# EAGLE design MOD-Y_V10 (EAGLE 9.6.2)

## Sheet 1 of 2
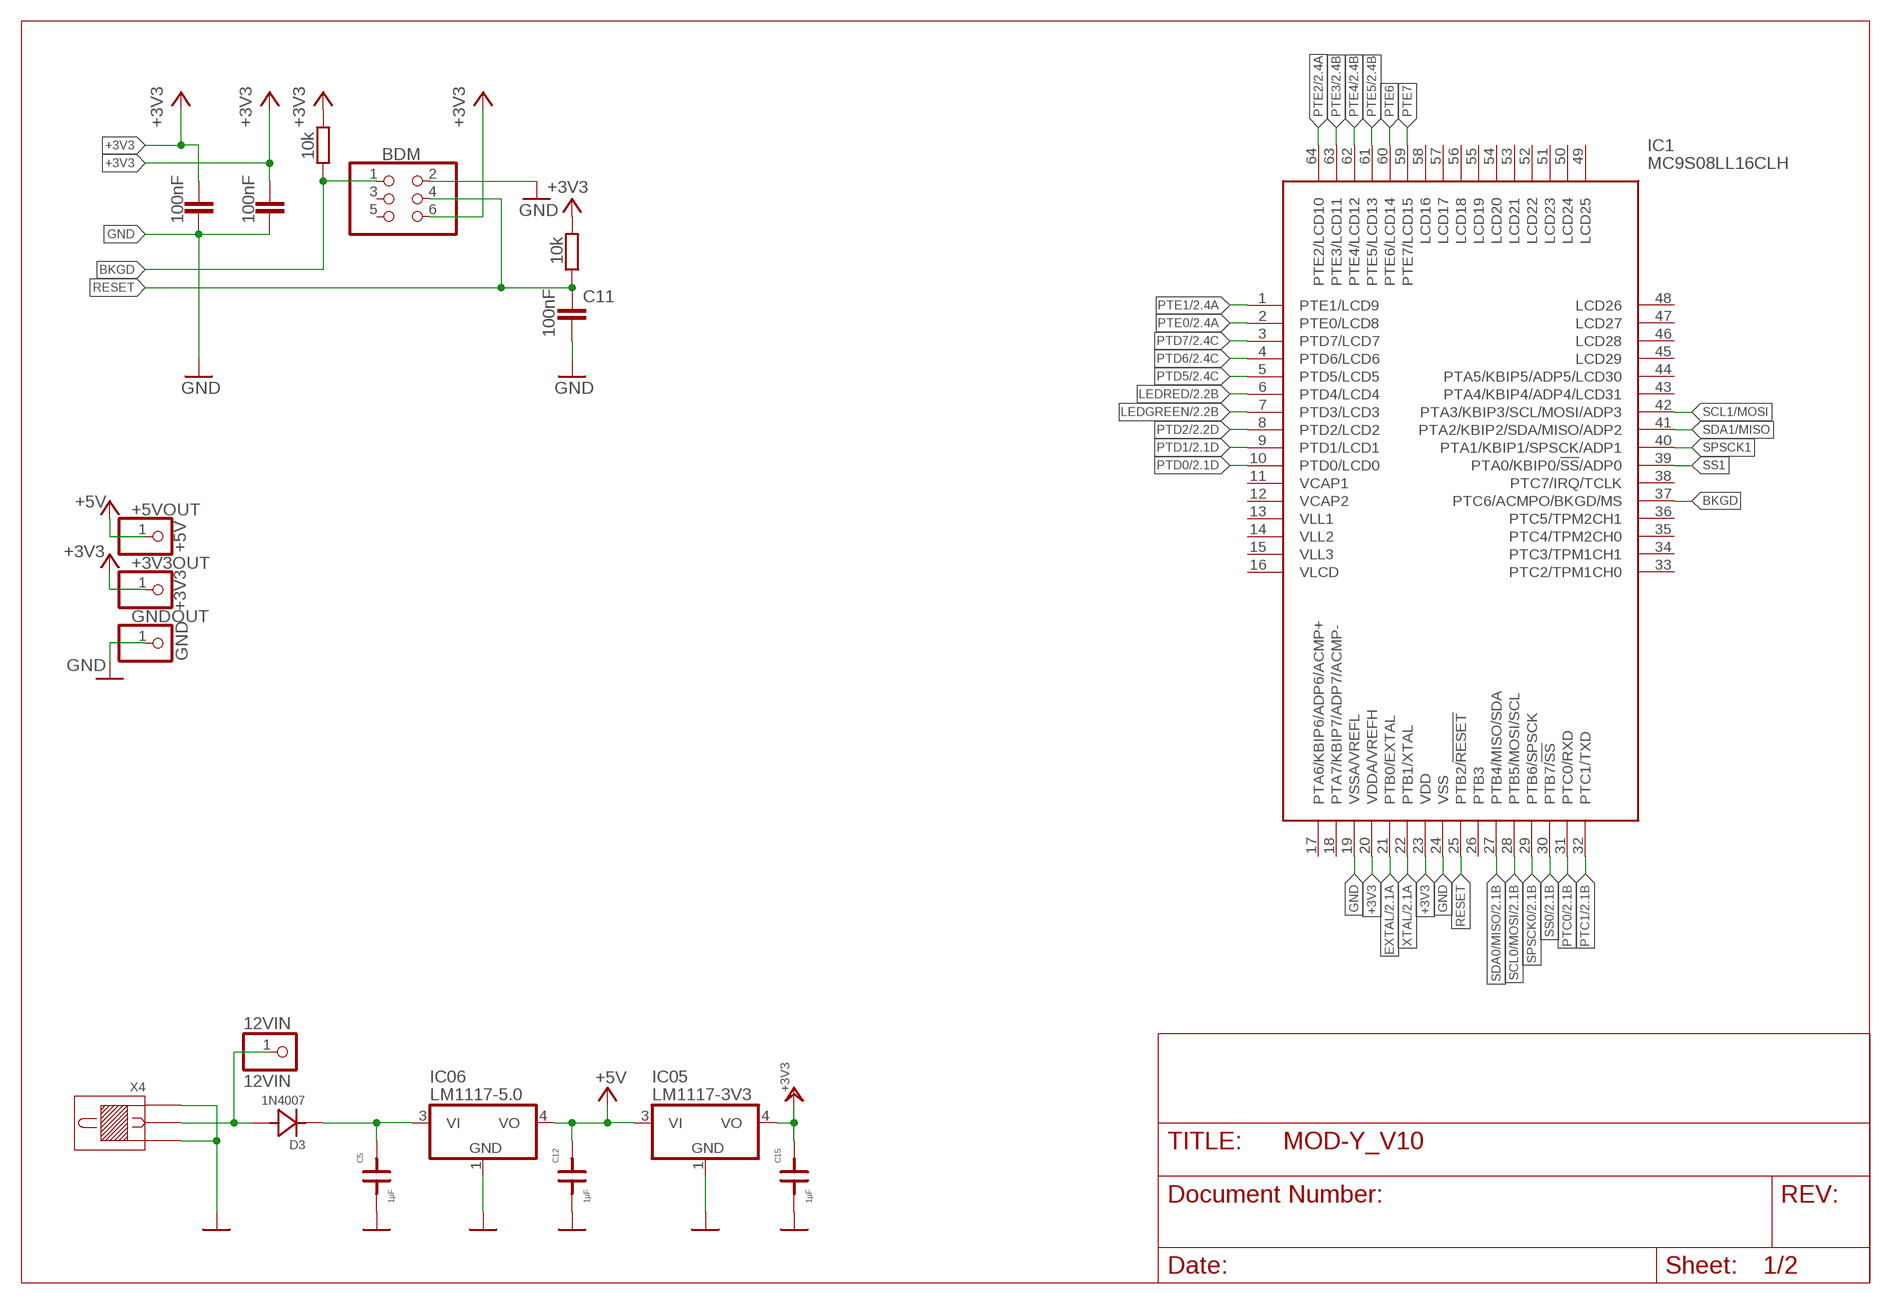
[diagram p0: schematic, sheet 1]

### Parts
12VIN  12VIN  PINHD-1X1  [1X01]
+3V3OUT  +3V3  PINHD-1X1  [1X01]
+5VOUT  +5V  PINHD-1X1  [1X01]
BDM  PINHD-2X3  [2X03]
C5  1µF  C1  [0805F]
C9  100nF  C-EUC0805  [C0805]
C10  100nF  C-EUC0805  [C0805]
C11  100nF  C-EUC0805  [C0805]
C12  1µF  C1  [0805F]
C15  1µF  C1  [0805F]
D3  1N4007  DHCMELF  [MELF_B]
GNDOUT  GND  PINHD-1X1  [1X01]
IC1  MC9S08LL16CLH  [QFP50P1200X1200X160-64N]
IC05  LM1117-3V3  LM1117DT  [DPAK]
IC06  LM1117-5.0  LM1117DT  [DPAK]
R16  10k  R-EU_R0805  [R0805]
R17  10k  R-EU_R0805  [R0805]
X4  SPP  [SPP]

### Nets
+3V3: +3V3OUT.1 BDM.6 C9.1 C10.1 C15.2 IC1.20(VDDA/VREFH) IC1.23(VDD) IC05.4(VO) R16.2 R17.2 ; also sheet 2
+5V: +5VOUT.1 C12.2 IC05.3(VI) IC06.4(VO) ; also sheet 2
BKGD: BDM.1 IC1.37(PTC6/ACMPO/BKGD/MS) R16.1
EXTAL: IC1.21(PTB0/EXTAL) ; also sheet 2
GND: BDM.2 C5.1 C9.2 C10.2 C11.2 C12.1 C15.1 GNDOUT.1 IC1.19(VSSA/VREFL) IC1.24(VSS) IC05.1(GND) IC06.1(GND) X4.1 X4.3 ; also sheet 2
LEDGREEN: IC1.7(PTD3/LCD3) ; also sheet 2
LEDRED: IC1.6(PTD4/LCD4) ; also sheet 2
N$70: C5.2 D3.K IC06.3(VI)
N$71: 12VIN.1 D3.A X4.2
PTC0: IC1.31(PTC0/RXD) ; also sheet 2
PTC1: IC1.32(PTC1/TXD) ; also sheet 2
PTD0: IC1.10(PTD0/LCD0) ; also sheet 2
PTD1: IC1.9(PTD1/LCD1) ; also sheet 2
PTD2: IC1.8(PTD2/LCD2) ; also sheet 2
PTD5: IC1.5(PTD5/LCD5) ; also sheet 2
PTD6: IC1.4(PTD6/LCD6) ; also sheet 2
PTD7: IC1.3(PTD7/LCD7) ; also sheet 2
PTE0: IC1.2(PTE0/LCD8) ; also sheet 2
PTE1: IC1.1(PTE1/LCD9) ; also sheet 2
PTE2: IC1.64(PTE2/LCD10) ; also sheet 2
PTE3: IC1.63(PTE3/LCD11) ; also sheet 2
PTE4: IC1.62(PTE4/LCD12) ; also sheet 2
PTE5: IC1.61(PTE5/LCD13) ; also sheet 2
PTE6: IC1.60(PTE6/LCD14)
PTE7: IC1.59(PTE7/LCD15)
RESET: BDM.4 C11.1 IC1.25(PTB2/!RESET) R17.1
SCL0/MOSI: IC1.28(PTB5/MOSI/SCL) ; also sheet 2
SCL1/MOSI: IC1.42(PTA3/KBIP3/SCL/MOSI/ADP3)
SDA0/MISO: IC1.27(PTB4/MISO/SDA) ; also sheet 2
SDA1/MISO: IC1.41(PTA2/KBIP2/SDA/MISO/ADP2)
SPSCK0: IC1.29(PTB6/SPSCK) ; also sheet 2
SPSCK1: IC1.40(PTA1/KBIP1/SPSCK/ADP1)
SS0: IC1.30(PTB7/!SS) ; also sheet 2
SS1: IC1.39(PTA0/KBIP0/!SS!/ADP0)
XTAL: IC1.22(PTB1/XTAL) ; also sheet 2
Unconnected: BDM.3 BDM.5 IC1.11(VCAP1) IC1.12(VCAP2) IC1.13(VLL1) IC1.14(VLL2) IC1.15(VLL3) IC1.16(VLCD) IC1.17(PTA6/KBIP6/ADP6/ACMP+) IC1.18(PTA7/KBIP7/ADP7/ACMP-) IC1.26(PTB3) IC1.33(PTC2/TPM1CH0) IC1.34(PTC3/TPM1CH1) IC1.35(PTC4/TPM2CH0) IC1.36(PTC5/TPM2CH1) IC1.38(PTC7/IRQ/TCLK) IC1.43(PTA4/KBIP4/ADP4/LCD31) IC1.44(PTA5/KBIP5/ADP5/LCD30) IC1.45(LCD29) IC1.46(LCD28) IC1.47(LCD27) IC1.48(LCD26) IC1.49(LCD25) IC1.50(LCD24) IC1.51(LCD23) IC1.52(LCD22) IC1.53(LCD21) IC1.54(LCD20) IC1.55(LCD19) IC1.56(LCD18) IC1.57(LCD17) IC1.58(LCD16)

## Sheet 2 of 2
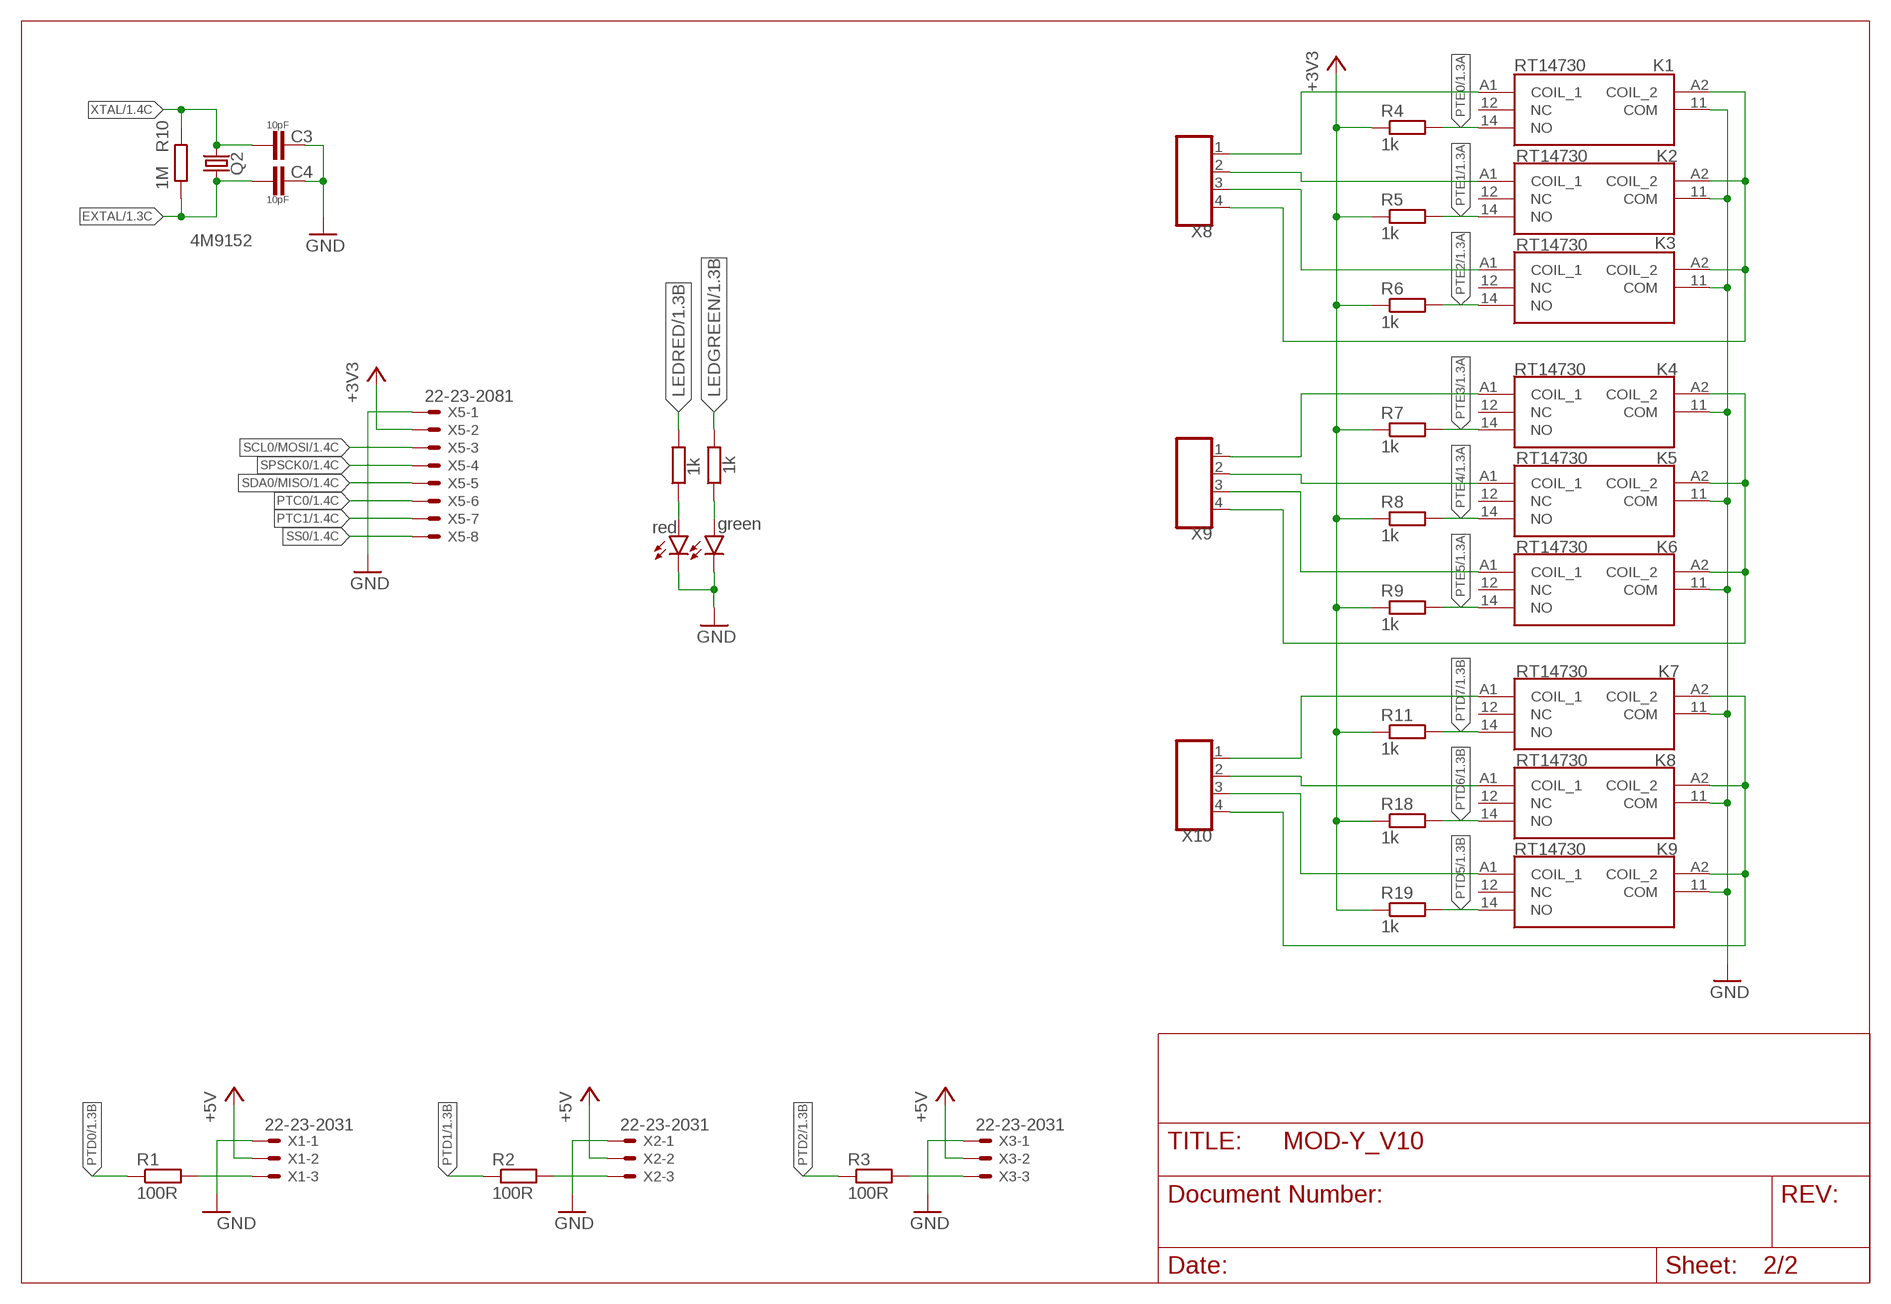
[diagram p1: schematic, sheet 2]

### Parts
C3  10pF  C-EUC0805  [C0805]
C4  10pF  C-EUC0805  [C0805]
K1  RT14730  [RT14730]
K2  RT14730  [RT14730]
K3  RT14730  [RT14730]
K4  RT14730  [RT14730]
K5  RT14730  [RT14730]
K6  RT14730  [RT14730]
K7  RT14730  [RT14730]
K8  RT14730  [RT14730]
K9  RT14730  [RT14730]
LED1  green  LEDCHIP-LED0805  [CHIP-LED0805]
LED2  red  LEDCHIP-LED0805  [CHIP-LED0805]
Q2  4M9152  CRYSTALHC49UP  [HC49UP]
R1  100R  R-EU_R0805  [R0805]
R2  100R  R-EU_R0805  [R0805]
R3  100R  R-EU_R0805  [R0805]
R4  1k  R-EU_R0805  [R0805]
R5  1k  R-EU_R0805  [R0805]
R6  1k  R-EU_R0805  [R0805]
R7  1k  R-EU_R0805  [R0805]
R8  1k  R-EU_R0805  [R0805]
R9  1k  R-EU_R0805  [R0805]
R10  1M  R-EU_R0805  [R0805]
R11  1k  R-EU_R0805  [R0805]
R12  1k  R-EU_R0805  [R0805]
R13  1k  R-EU_R0805  [R0805]
R18  1k  R-EU_R0805  [R0805]
R19  1k  R-EU_R0805  [R0805]
X1  22-23-2031  [22-23-2031]
X2  22-23-2031  [22-23-2031]
X3  22-23-2031  [22-23-2031]
X5  22-23-2081  [22-23-2081]
X8  KLEMME4  [KLEMME4]
X9  KLEMME4  [KLEMME4]
X10  KLEMME4  [KLEMME4]

### Nets
+3V3: R4.1 R5.1 R6.1 R7.1 R8.1 R9.1 R11.1 R18.1 R19.1 X5.2 ; also sheet 1
+5V: X1.2 X2.2 X3.2 ; also sheet 1
EXTAL: C4.1 Q2.1 R10.1 ; also sheet 1
GND: C3.2 C4.2 K1.11(COM) K2.11(COM) K3.11(COM) K4.11(COM) K5.11(COM) K6.11(COM) K7.11(COM) K8.11(COM) K9.11(COM) LED1.C LED2.C X1.1 X2.1 X3.1 X5.1 ; also sheet 1
LEDGREEN: R13.2 ; also sheet 1
LEDRED: R12.2 ; also sheet 1
N$1: K1.A1(COIL_1) X8.1
N$2: K2.A1(COIL_1) X8.2
N$3: R1.2 X1.3
N$4: K3.A1(COIL_1) X8.3
N$5: K1.A2(COIL_2) K2.A2(COIL_2) K3.A2(COIL_2) X8.4
N$6: R2.2 X2.3
N$7: K4.A1(COIL_1) X9.1
N$10: K5.A1(COIL_1) X9.2
N$11: R3.2 X3.3
N$12: K6.A1(COIL_1) X9.3
N$13: K4.A2(COIL_2) K5.A2(COIL_2) K6.A2(COIL_2) X9.4
N$14: K7.A1(COIL_1) X10.1
N$15: K8.A1(COIL_1) X10.2
N$16: K9.A1(COIL_1) X10.3
N$17: LED2.A R12.1
N$18: LED1.A R13.1
N$19: K7.A2(COIL_2) K8.A2(COIL_2) K9.A2(COIL_2) X10.4
PTC0: X5.6 ; also sheet 1
PTC1: X5.7 ; also sheet 1
PTD0: R1.1 ; also sheet 1
PTD1: R2.1 ; also sheet 1
PTD2: R3.1 ; also sheet 1
PTD5: K9.14(NO) R19.2 ; also sheet 1
PTD6: K8.14(NO) R18.2 ; also sheet 1
PTD7: K7.14(NO) R11.2 ; also sheet 1
PTE0: K1.14(NO) R4.2 ; also sheet 1
PTE1: K2.14(NO) R5.2 ; also sheet 1
PTE2: K3.14(NO) R6.2 ; also sheet 1
PTE3: K4.14(NO) R7.2 ; also sheet 1
PTE4: K5.14(NO) R8.2 ; also sheet 1
PTE5: K6.14(NO) R9.2 ; also sheet 1
SCL0/MOSI: X5.3 ; also sheet 1
SDA0/MISO: X5.5 ; also sheet 1
SPSCK0: X5.4 ; also sheet 1
SS0: X5.8 ; also sheet 1
XTAL: C3.1 Q2.2 R10.2 ; also sheet 1
Unconnected: K1.12(NC) K2.12(NC) K3.12(NC) K4.12(NC) K5.12(NC) K6.12(NC) K7.12(NC) K8.12(NC) K9.12(NC)

## Library data of the parts
12VIN +3V3OUT +5VOUT GNDOUT = pinhead:PINHD-1X1: PIN HEADER
BDM = pinhead:PINHD-2X3: PIN HEADER
C3 C4 C9-C11 = rcl:C-EU: CAPACITOR, European symbol; SPICEPREFIX: C
C5 C12 C15 = deto:C
D3 = deto:DHC: Hii-Curr-Diode, Silizium, Typ Gleichrichter z.B. wie 1N4007 oder ähnlich
IC1 = MC9S08LL16CLH:MC9S08LL16CLH: MCU 8-bit S08 CISC 16KB Flash 2.5V/3.3V 64-Pin LQFP Tray Source: Datasheet <http://www.nxp.com/docs/en/data-sheet/MC9S08LL16.pdf>; ARROW_PART_NUMBER: MC9S08LL16CLH; ARROW_PRICE-STOCK: https://www.arrow.com/en/products/mc9s08ll16clh/nxp-semiconductors; DESCRIPTION: MCU 8-bit S08 CISC 16KB Flash 2.5V/3.3V 64-Pin LQFP Tray; HEIGHT: 1.6mm; MANUFACTURER_NAME: NXP; MANUFACTURER_PART_NUMBER: MC9S08LL16CLH; MOUSER_PART_NUMBER: 841-MC9S08LL16CLH; MOUSER_PRICE-STOCK: https://www.mouser.com/Search/Refine.aspx?Keyword=841-MC9S08LL16CLH
IC05 IC06 = deto:LM1117: Spannungsregler Fix oder einstellbar LM1117XX-YY wobei XX die Gehäuseform angibt (DT = Dpak) und YY die Spannung angibt (z.B. 5.0 für 5V oder ADJ für einstellbar)
K1-K9 = rt14730:RT14730: Power PCB Relay RT1 Source: Datasheet <https://www.farnell.com/datasheets/2611146.pdf>; DESCRIPTION: Power PCB Relay RT1; HEIGHT: 15.7mm; MANUFACTURER_NAME: DEUTSCH - TE CONNECTIVITY; MANUFACTURER_PART_NUMBER: rt14730
LED1 LED2 = led:LED: LED OSRAM: - CHIPLED LG R971, LG N971, LY N971, LG Q971, LY Q971, LO R971, LY R971 LH N974, LH R974 LS Q976, LO Q976, LY Q976 LO Q996 - Hyper CHIPLED LW Q18S LB Q993, LB Q99A, LB R99A - SideLED LS A670, LO A670, LY A670, LG A670, LP A670 LB A673, LV A673, LT A673, LW A673 LH A674 LY A675 LS A676, LA A676, LO A676, LY A676, LW A676 LS A679, LY A679, LG A679 - Hyper Micro SIDELED® LS Y876, LA Y876, LO Y876, LY Y876 LT Y87S - SmartLED LW L88C, LW L88S LB L89C, LB L89S, LG L890 LS L89K, LO L89K, LY L89K LS L896, LA L896, LO L896, LY L896 - TOPLED LS T670, LO T670, LY T670, LG T670, LP T670 LSG T670, LSP T670, LSY T670, LOP T670, LYG T670 LG T671, LOG T671, LSG T671 LB T673, LV T673, LT T673, LW T673 LH T674 LS T676, LA T676, LO T676, LY T676, LB T676, LH T676, LSB T676, LW T676 LB T67C, LV T67C, LT T67C, LS T67K, LO T67K, LY T67K, LW E67C LS E67B, LA E67B, LO E67B, LY E67B, LB E67C, LV E67C, LT E67C LW T67C LS T679, LY T679, LG T679 LS T770, LO T770, LY T770, LG T770, LP T770 LB T773, LV T773, LT T773, LW T773 LH T774 LS E675, LA E675, LY E675, LS T675 LS T776, LA T776, LO T776, LY T776, LB T776 LHGB T686 LT T68C, LB T68C - Hyper Mini TOPLED® LB M676 - Mini TOPLED Santana® LG M470 LS M47K, LO M47K, LY M47K Source: http://www.osram.convergy.de LUXEON: - LUMILED® LXK2-PW12-R00, LXK2-PW12-S00, LXK2-PW14-U00, LXK2-PW14-V00 LXK2-PM12-R00, LXK2-PM12-S00, LXK2-PM14-U00 LXK2-PE12-Q00, LXK2-PE12-R00, LXK2-PE12-S00, LXK2-PE14-T00, LXK2-PE14-U00 LXK2-PB12-K00, LXK2-PB12-L00, LXK2-PB12-M00, LXK2-PB14-N00, LXK2-PB14-P00, LXK2-PB14-Q00 LXK2-PR12-L00, LXK2-PR12-M00, LXK2-PR14-Q00, LXK2-PR14-R00 LXK2-PD12-Q00, LXK2-PD12-R00, LXK2-PD12-S00 LXK2-PH12-R00, LXK2-PH12-S00 LXK2-PL12-P00, LXK2-PL12-Q00, LXK2-PL12-R00 Source: www.luxeon.com KINGBRIGHT: KA-3528ASYC Source: www.kingbright.com
Q2 = crystal:CRYSTAL: CRYSTAL; OC_FARNELL: unknown; OC_NEWARK: unknown
R1-R13 R16-R19 = rcl:R-EU_: RESISTOR, European symbol; SPICEPREFIX: R
X1-X3 = con-molex:22-23-2031: .100" (2.54mm) Center Header - 3 Pin; MF: MOLEX; MPN: 22-23-2031; OC_FARNELL: 1462950; OC_NEWARK: 30C0862
X4 = CONNECT:SPP
X5 = con-molex:22-23-2081: .100" (2.54mm) Center Header - 8 Pin; MF: MOLEX; MPN: 22-23-2081; OC_FARNELL: 1756826; OC_NEWARK: 01C7592
X8-X10 = CONNECT:KLEMME4

## Board
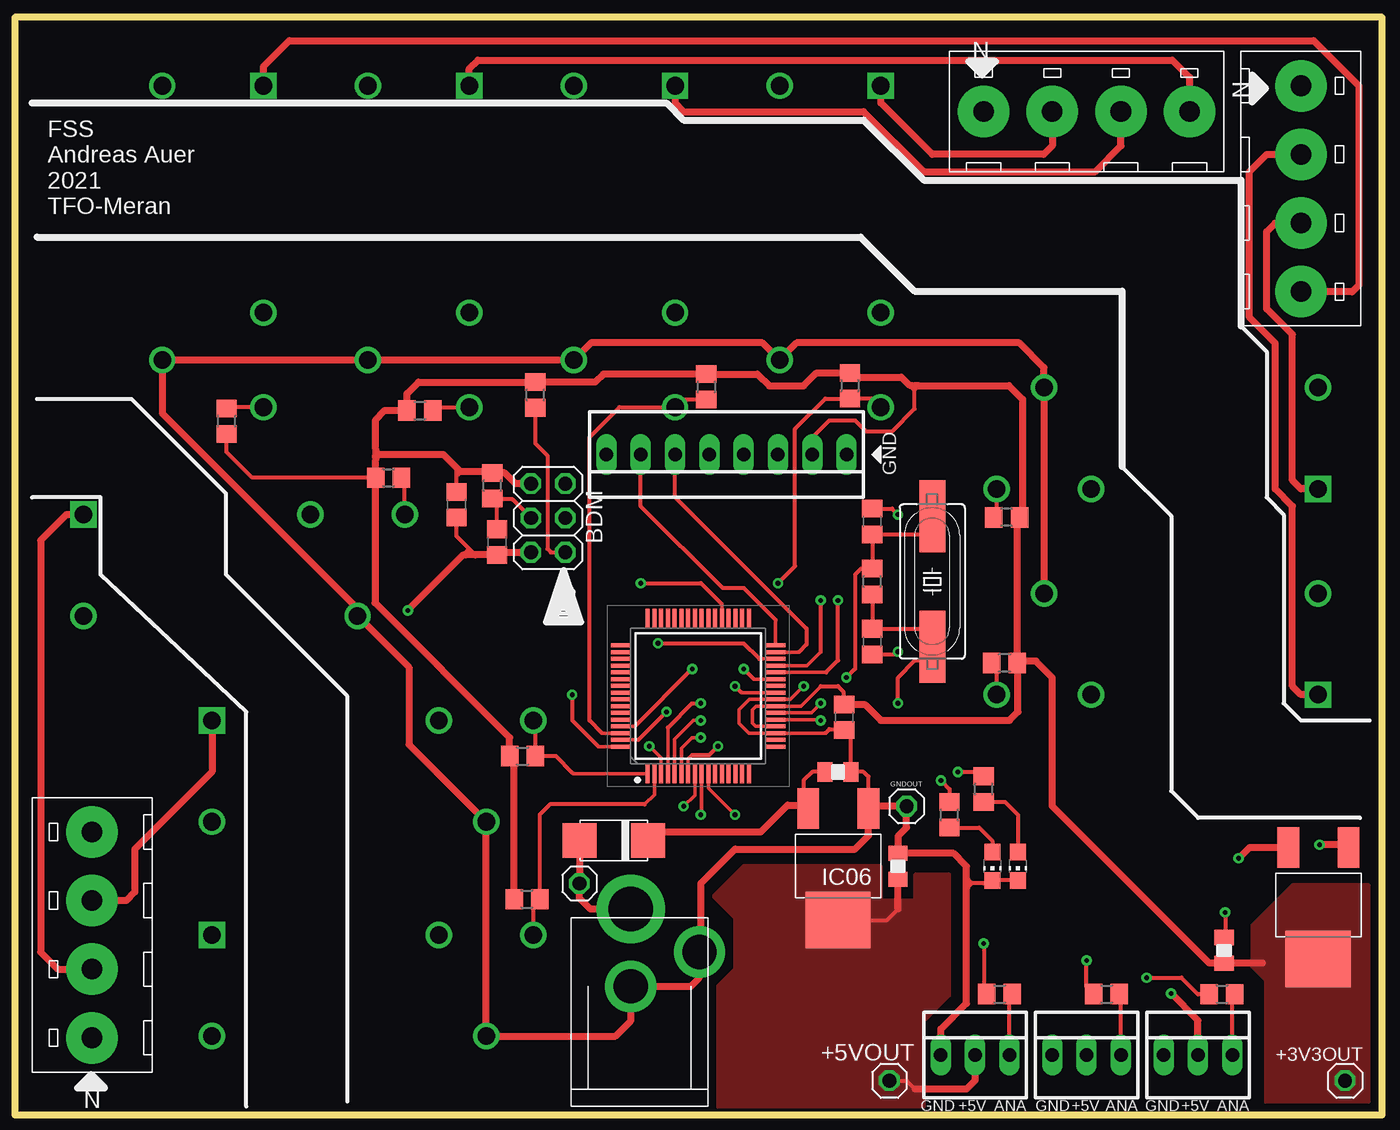
[diagram p2: board, top side]
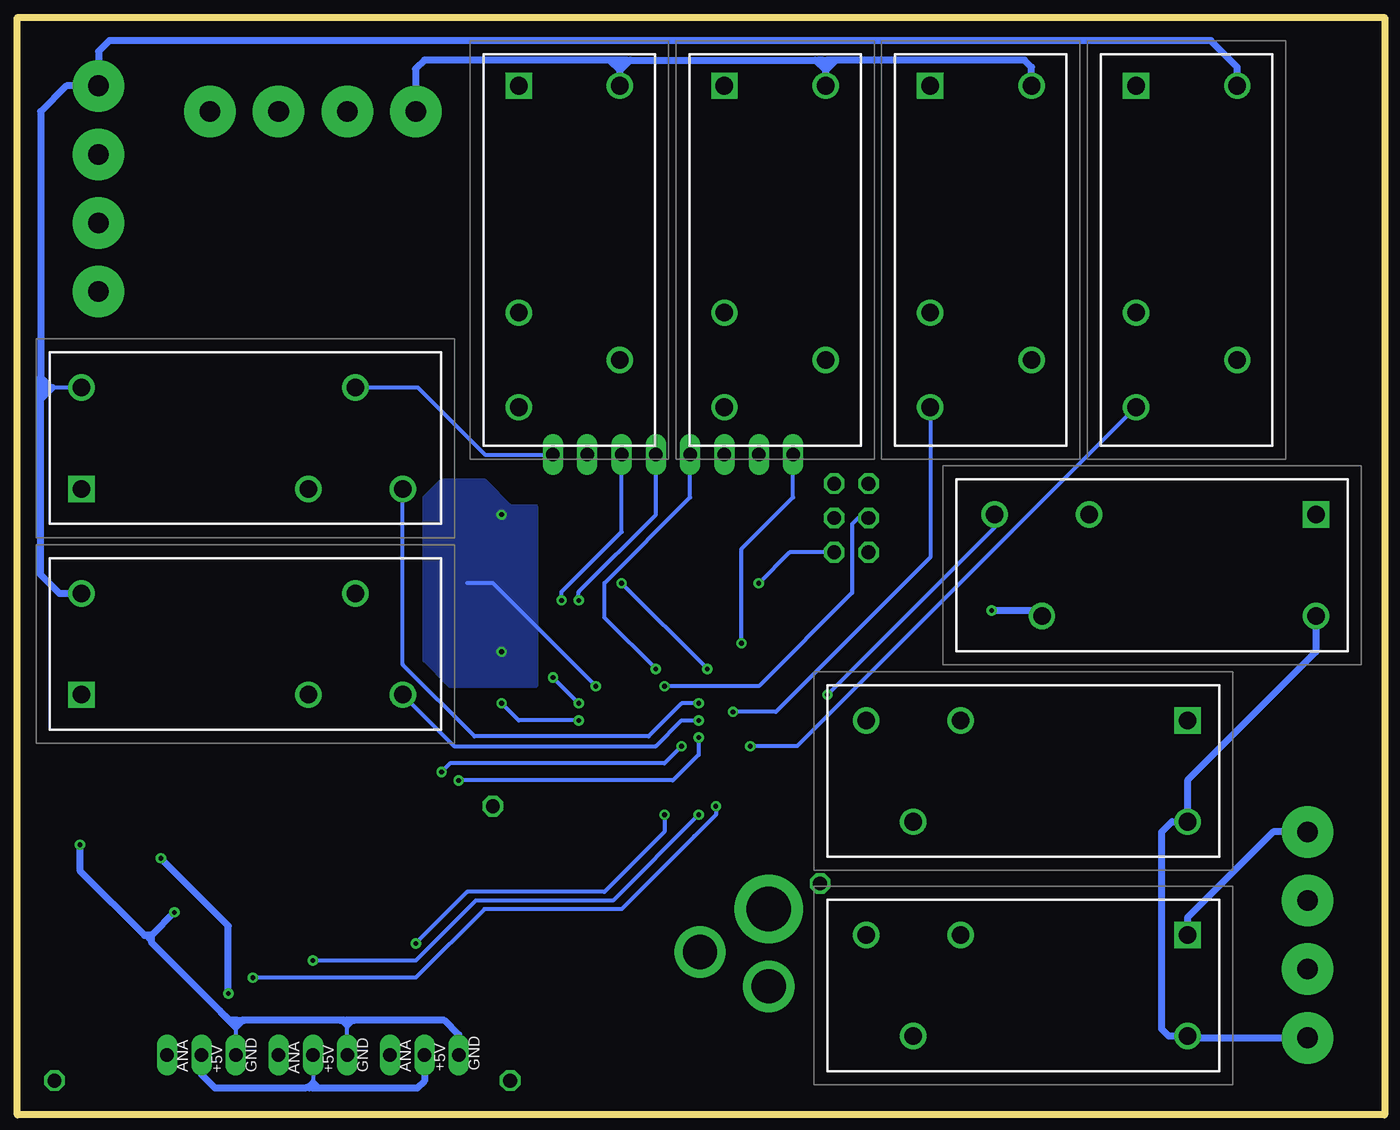
[diagram p3: board, bottom side, seen from below]

No outline drawn. Coordinates in mm, seen from the top.
Copper layers (1*16): Top 0.035mm / dielectric 1.5mm / Bottom 0.035mm
Design rules "default *": minimum track width 6mil, minimum drill 0.35mm, track to track 12mil, track to pad 12mil, pad to pad 12mil, via to via 12mil, smd to smd 12mil, copper to edge 40mil, drill to drill 12mil, minimum pad ring 10mil, minimum via ring 8mil, stop-mask expansion 4mil, vias tented up to drill 0mil, thermal gap 10mil
Milling: 4 lines

### Footprints (pad centres in the part's own frame; a part is rotated, then mirrored left to right if it is on the bottom)
1X01 = drill 1.016 octagon: 1 0,0
2X03 = drill 1.016 octagon: 1 -2.54,-1.27; 2 -2.54,1.27; 3 0,-1.27; 4 0,1.27; 5 2.54,-1.27; 6 2.54,1.27
C0805 = smd 1.3 x 1.5: 1 -0.95,0; 2 0.95,0
0805F = smd 1.118 x 1.422: 1 -0.953,0; 2 0.953,0
MELF_B = smd 2.54 x 2.54: A 2.54,0; K -2.54,0
QFP50P1200X1200X160-64N = smd 1.475 x 0.3: 1 -5.738,3.75; 2 -5.738,3.25; 3 -5.738,2.75; 4 -5.738,2.25; 5 -5.738,1.75; 6 -5.738,1.25; 7 -5.738,0.75; 8 -5.738,0.25; 9 -5.738,-0.25; 10 -5.738,-0.75; 11 -5.738,-1.25; 12 -5.738,-1.75; 13 -5.738,-2.25; 14 -5.738,-2.75; 15 -5.738,-3.25; 16 -5.738,-3.75; 33 5.738,-3.75; 34 5.738,-3.25; 35 5.738,-2.75; 36 5.738,-2.25; 37 5.738,-1.75; 38 5.738,-1.25; 39 5.738,-0.75; 40 5.738,-0.25; 41 5.738,0.25; 42 5.738,0.75; 43 5.738,1.25; 44 5.738,1.75; 45 5.738,2.25; 46 5.738,2.75; 47 5.738,3.25; 48 5.738,3.75 | smd 0.3 x 1.475: 17 -3.75,-5.738; 18 -3.25,-5.738; 19 -2.75,-5.738; 20 -2.25,-5.738; 21 -1.75,-5.738; 22 -1.25,-5.738; 23 -0.75,-5.738; 24 -0.25,-5.738; 25 0.25,-5.738; 26 0.75,-5.738; 27 1.25,-5.738; 28 1.75,-5.738; 29 2.25,-5.738; 30 2.75,-5.738; 31 3.25,-5.738; 32 3.75,-5.738; 49 3.75,5.738; 50 3.25,5.738; 51 2.75,5.738; 52 2.25,5.738; 53 1.75,5.738; 54 1.25,5.738; 55 0.75,5.738; 56 0.25,5.738; 57 -0.25,5.738; 58 -0.75,5.738; 59 -1.25,5.738; 60 -1.75,5.738; 61 -2.25,5.738; 62 -2.75,5.738; 63 -3.25,5.738; 64 -3.75,5.738
DPAK = smd 1.6 x 2.997: 1 -2.261,-3.658; 3 2.21,-3.658 | smd 4.826 x 4.191: 4 0,4.623
RT14730 = drill 1.3 pad 1.95: 11 20.3,7.5; 12 16.8,0; 14 23.8,0; A2 0,7.5 | drill 1.3 pad 1.95 square: A1 0,0
CHIP-LED0805 = smd 1.2 x 1.2: A 0,-1.05; C 0,1.05
HC49UP = smd 5.334 x 1.93: 1 -4.826,0; 2 4.826,0
R0805 = smd 1.3 x 1.5: 1 -0.95,0; 2 0.95,0
22-23-2031 = drill 1 long: 1 -2.54,0; 2 0,0; 3 2.54,0
SPP = drill 2.54 pad 3.81: 1 0,0; 3 -2.54,5.08 | drill 3.302 pad 5.08: 2 -5.715,0
22-23-2081 = drill 1 long: 1 -8.89,0; 2 -6.35,0; 3 -3.81,0; 4 -1.27,0; 5 1.27,0; 6 3.81,0; 7 6.35,0; 8 8.89,0
KLEMME4 = drill 1.524 pad 3.81: 1 0,-7.62; 2 0,-2.54; 3 0,2.54; 4 0,7.62

### Placement (x,y rotation side)
12VIN  41.18,17.14 0 top
+3V3OUT  97.89,2.54 0 top
+5VOUT  64.14,2.54 0 top
BDM  38.86,44.2 90 top
C3  62.87,43.94 90 top
C4  62.87,35.05 270 top
C5  60.33,25.4 180 top
C9  32.08,45.19 270 top
C10  60.79,29.45 270 top
C11  35.09,42.41 270 top
C12  64.77,18.41 270 top
C15  88.92,12.19 270 top
D3  43.72,20.32 180 top
GNDOUT  65.41,22.86 0 top
IC1  49.98,31.02 90 top
IC05  95.89,16.16 180 top
IC06  60.33,19.05 180 top
K1  13.97,13.34 180 bottom
K2  13.97,29.21 180 bottom
K3  4.45,44.45 180 bottom
K4  33.02,76.2 270 bottom
K5  48.26,76.2 270 bottom
K6  63.5,76.2 270 bottom
K7  17.78,76.2 270 bottom
K8  95.89,46.35 0 bottom
K9  95.89,31.11 0 bottom
LED1  73.66,18.41 180 top
LED2  71.75,18.41 180 top
Q2  67.31,39.49 90 top
R1  72.29,8.95 0 top
R2  80.21,8.95 0 top
R3  88.76,8.94 0 top
R4  37.29,15.98 0 top
R5  36.97,26.57 0 top
R6  27.04,47.19 0 top
R7  29.36,52.16 0 top
R8  50.57,53.91 270 top
R9  61.2,53.99 270 top
R10  62.87,39.49 90 top
R11  15.05,51.37 90 top
R12  68.58,22.23 90 top
R13  71.12,24.13 90 top
R16  37.91,53.31 90 top
R17  34.73,46.59 90 top
R18  72.81,44.24 180 top
R19  72.65,33.46 180 top
X1  70.48,4.45 0 top
X2  78.74,4.45 0 top
X3  87,4.45 0 top
X4  44.99,9.53 270 top
X5  52.07,48.9 180 top
X8  5.08,13.34 180 top
X9  78.74,74.3 90 top
X10  94.61,68.58 0 top

### Tracks (layer width: path | path; a pad name or v marks a point on that pad's centre or on a via)
+3V3
  Top 0.254: IC1.20 54.23,28.77 54,29 54,30 54.27,30.27 IC1.23 57.58,30.27 59.05,31.75
  Top 0.305: 36.34,26.25 R5.1 | R11.1 15.05,49.09 16.95,47.19 R6.1 26.04,47.13 | R9.1 61.51,54.63 | 74,44.48 R18.1 73.6,44.08 | R19.1 73.6,33.66 73.66,33.59 | 66,53.66 66,52.27 64.36,50.63 62.4,50.63 61.59,51.44 59.69,51.44 58.42,50.16 X5.2 | 66,53.71 66,53.83 | 66,53.83 66,54 66.17,54 66,53.83 | C10.1 60.73,30.46 60.73,31.34 60.33,31.75 59.05,31.75 | 66,53.83 65.83,54 65.66,54 66,53.66 | 66,53.71 66,53.66 | 66,53.71 66.29,54 | C9.1 32.08,47.31 | 32.08,47.31 32.19,47.43 | 32.19,47.43 32.38,47.62 32.2,47.62 | 34.65,47.62 R17.2 | 32.08,47.31 32.08,47.62 | 32.08,47.94 32.08,47.75 | 32.08,47.75 32.08,47.62 | 26.09,48.9 26.34,48.9 | 26.47,48.9 26.09,48.51 26.09,48.64 26.34,48.9 | 26.34,48.9 26.47,48.9 | 26.47,48.9 26.21,49.15 | 26.21,49.15 26.09,49.15 26.09,49.28 26.21,49.15 | 26.34,48.9 26.21,49.02 26.09,49.02 | 32.2,47.62 32.08,47.62 | 32.08,47.62 32.19,47.51 32.19,47.43 | 32.2,47.62 32.08,47.75
  Top 0.508: R4.1 36.34,26.25 | R5.1 36.02,27.94 26.04,37.92 26.04,47.13 | R6.1 26.09,48.51 | 26.09,48.64 26.09,48.9 26.09,49.02 26.09,49.15 | 26.09,49.28 26.09,51.48 26.76,52.16 R7.1 28.41,53.41 29.26,54.26 R16.2 42.35,54.26 42.95,54.86 R8.1 54.36,54.86 55.24,53.98 57.78,53.98 58.75,54.94 R9.1 | 74,44.48 74,53 73,54 66.29,54 66.17,54 | 61.51,54.63 65.02,54.63 65.66,54 | 65.83,54 66,54 | 73.6,33.66 73.6,44.08 | 91.76,11.24 C15.2 87.82,11.24 76.2,22.86 76.2,32.38 74.99,33.59 73.66,33.59 73.66,29.84 73.03,29.21 63.5,29.21 62.31,30.4 C10.1 | BDM.6 36.45,46.74 35.64,47.55 R17.2 | 34.65,47.62 32.38,47.62 32.08,47.94 31.11,48.9 26.47,48.9
  pour Top (no thermals): 99.64,17 94,17 91,14 91,11 92,10 92,1 99.64,1
+5V  (via drill 0.35)
  Top 0.305: IC06.4 63.96,14.43 64.77,15.24 | +5VOUT.1 65.41,2.54 66.04,1.91
  Top 0.508: X3.2 87,7 v85,9 | 64.77,15.24 C12.2 | X1.2 70.48,2.54 69.85,1.91 66.04,1.91 | v90,19 90.82,19.82 IC05.3
  Bottom 0.305: X3.2 | X2.2 78.74,2.54 | 78.74,2.54 78.74,2.26 | 78.74,2.26 78.85,2.15 | 78.63,2.15 78.74,2.26 | 78.77,2 78.63,2.15 | 79,2 78.85,2.15 | 78.85,2.15 78.63,2.15 | 79.28,2 78.74,2.54 | 78.2,2 78.74,2.54
  Bottom 0.508: X3.2 87,3 86,2 79.28,2 79,2 78.77,2 78.48,2 | X1.2 70.48,2.52 71,2 78.2,2 78.48,2 | v85,9 85,14 v90,19 | 78.48,2 78.63,2.15
  pour Top (no thermals): 63.5,18.41 53.34,18.41 51.12,16.19 52.7,14.61 52.7,10.79 51.44,9.53 51.44,0.64 66.67,0.64 66.67,6.99 68.58,8.89 68.58,17.78 66.04,17.78 66.04,15.88 63.5,15.88
BKGD  (via drill 0.35)
  Top 0.254: 51.73,37.81 IC1.37
  Top 0.305: v45.72,39.37 50.16,39.37 51.73,37.81 | R16.1 37.91,49.73 38.81,48.82 38.81,41.91 39.06,41.66 BDM.1
  Bottom 0.305: BDM.1 43.43,41.66 v45.72,39.37
EXTAL  (via drill 0.35)
  Top 0.254: IC1.21 58.99,29.27
  Top 0.305: R10.1 C4.1 66.87,36 67.31,35.56 Q2.1 67.31,33.66 66.04,33.66 64.77,32.38 v64.77,30.48 | 58.99,29.27 v59.05,29.21
  Bottom 0.305: v59.05,29.21 63.5,29.21 v64.77,30.48
GND  (via drill 0.35)
  Top 0.254: 59.38,28.27 IC1.19 53.73,28.27 53,29 53,30 53.77,30.77 IC1.24 56.8,30.77 v57.78,31.75
  Top 0.305: 62.74,22.86 IC06.1 62.59,25.04 62.23,25.4 C5.1 61.28,28.01 C10.2 60.75,28.46 60.63,28.57 59.69,28.57 59.38,28.27 | IC05.1 97.96,20 | v89,15 89,13.22 C15.1 | X4.3 50.16,12.16 | C11.2 35.28,41.66 | C9.2 32.08,42.85 33.02,41.91 | 33.47,41.47 33.34,41.59 | 33.34,41.59 33.02,41.91 | 32.77,41.47 32.7,41.47 | 33.02,41.91 32.96,41.85 | 32.96,41.85 32.58,41.47 32.7,41.47 | 33.34,41.59 33.21,41.59 | 33.21,41.59 33.02,41.78 | 33.02,41.78 32.96,41.85 | 32.7,41.47 32.89,41.66 | 32.89,41.66 33.02,41.78 | 33.21,41.59 32.96,41.59 32.89,41.66 | 33.02,41.91 33.02,41.72 | C3.2 64.33,44.89 v64.77,44.45 | C4.2 64.58,34.1 v64.77,34.29 | LED1.C LED2.C 71.53,17.14 71.12,17.14 70.23,17.14 | 70.23,17.14 69.85,17.14 | 70.23,17.14 69.85,17.53 | 70.23,17.14 69.85,16.76
  Top 0.508: K9.11 K8.11 75.58,55.34 73.75,57.17 57.27,57.17 K6.11 54.73,57.17 42.03,57.17 K5.11 K4.11 K7.11 10.28,51.95 24.75,37.48 K3.11 28.55,33.14 28.55,27.43 K2.11 K1.11 43.84,5.83 44.99,6.99 X4.1 49.44,9.53 50.07,10.16 X4.3 | 97.96,20 v96,20 | X1.1 67.94,6.35 69.85,8.26 69.85,16.76 69.85,17.14 69.85,17.53 69.85,18.41 68.9,19.37 C12.1 64.77,20.64 65.41,21.27 GNDOUT.1 62.74,22.86 | 50.16,12.16 50.16,17.14 52.7,19.68 61.59,19.68 62.59,20.68 IC06.1 | 35.28,41.66 BDM.2 | C11.2 33.47,41.47 32.77,41.47 33.02,41.72 | 32.58,41.47 v28.46,37.35
  Bottom 0.305: X1.1 67.94,5.95 | 84.45,6.35 X3.1 | X2.1 76.2,6.48 | 76.2,6.48 76.2,6.8 | 76.2,6.8 76,7 | 91.22,13.31 91.09,13.18 | 91.09,13.18 90.95,13.04 | K8.11 70.95,53.85 65.99,48.9 X5.1 | 84.55,6.64 84.45,6.54 84.45,6.35 | 84.55,6.64 84.61,6.7 | 84.61,6.7 84.77,6.86 | 90.71,12.8 90.83,12.93 | 90.83,12.93 90.95,13.04 | 90.95,13.04 90.83,13.16 | 90.69,13.31 90.71,13.29 90.82,13.18 | 90.82,13.18 91.09,13.18 | 90.82,13.18 90.83,13.16 | 90.83,13.16 90.83,12.93 | 76.2,6.8 76.2,6.87 76.33,7 76.4,7 76.2,6.8 | 84.86,6.96 84.82,7 84.91,7 84.86,6.96 | 84.61,6.7 84.31,7 84.19,7 84.33,6.86 | 84.33,6.86 84.55,6.64 | 84.86,6.96 84.77,6.86 | 84.77,6.86 84.33,6.86 | 76.72,7 76.2,6.48 | 75.68,7 76.2,6.48 | 85.63,7.72 85.63,7.52 84.45,6.35 | 84.45,6.35 83.82,6.99 83.82,7 | v57.78,31.75 65.41,39.37 67.31,39.37
  Bottom 0.508: 67.94,5.95 69,7 75.68,7 76,7 76.33,7 | 76.4,7 76.72,7 83.82,7 84,7 | v96,20 96,18.09 91.22,13.31 90.69,13.31 v89,15 | 90.71,13.29 90.71,12.8 85.63,7.72 84.91,7 | 84.31,7 84.82,7 | 84.19,7 84,7 | v28.46,37.35 25.15,37.35 K3.11 | 84,7 84.45,6.54
  pour Bottom: 70.48,33.66 70.48,45.72 69.22,46.99 66.04,46.99 64.14,45.09 62.23,45.09 62.23,31.75 68.58,31.75
LEDGREEN  (via drill 0.35)
  Top 0.254: IC1.7 49.23,26.36 49.53,26.67
  Top 0.305: 49.53,26.67 50.8,26.67 v51.44,27.3 | v69.22,25.4 70.8,25.4 R13.2
  Bottom 0.305: v51.44,27.3 52.7,26.04 68.58,26.04 v69.22,25.4
LEDRED  (via drill 0.35)
  Top 0.254: IC1.6 48.73,27.14 49.53,27.94 v50.16,27.94
  Top 0.305: v67.94,24.77 68.58,24.13 R12.2
  Bottom 0.305: v50.16,27.94 50.16,26.67 52.07,24.77 v67.94,24.77
N$1
  Bottom 0.508: X8.1 7.62,20.95 13.97,14.61 K1.A1
N$2
  Top 0.508: K2.A1 13.97,25.4 8.26,19.68 8.26,16.51 7.62,15.88 X8.2
N$3
  Top 0.305: R1.2 73.14,8.86 73.03,8.73 X1.3
N$4
  Top 0.508: K3.A1 3.17,44.45 1.27,42.55 1.27,12.06 2.54,10.79 X8.3
N$5
  Bottom 0.508: K3.A2 4.45,34.29 13.97,24.77 K2.A2 15.12,21.71 15.88,20.95 15.88,6.35 15.36,5.83 K1.A2 13.85,5.71 X8.4
N$6
  Top 0.305: X2.3 81.28,8.83 R2.2
N$7
  Top 0.508: K4.A1 33.02,77.47 33.66,78.11 85.09,78.11 86.36,76.83 X9.1
N$10
  Top 0.508: K5.A1 48.26,74.93 48.9,74.3 62.23,74.3 66.67,69.85 79.38,69.85 81.28,71.75 X9.2
N$11
  Top 0.305: X3.3 89.53,8.76 R3.2
N$12
  Top 0.508: K6.A1 63.5,74.93 67.31,71.12 75.56,71.12 76.2,71.75 X9.3
N$13
  Bottom 0.508: 40,78.11 40.26,78.11 | 41.02,78.11 40.51,78.11 | 55.5,78.11 55.24,78.11 | 55.24,78.11 41.52,78.11 | 41.52,78.11 41.27,78.11 | 55.75,78.11 56.01,78.11 | 56.01,78.11 56.13,78.11 | 56.13,78.11 56.26,78.11 | 56.39,78.11 56.26,78.11 | 56.52,78.11 56.76,78.11 | 56.76,78.11 70.48,78.11 71.14,77.45 71.14,74.32 X9.4 | K4.A2 25.52,77.59 26.04,78.11 38.73,78.11 40,78.11 | K5.A2 40.76,77.34 | 40.76,77.34 40.76,77.59 | 40.76,77.59 40.83,77.66 | 40.83,77.66 40.89,77.72 | 40.89,77.72 40.96,77.79 | 40.96,77.79 41.27,78.11 | K6.A2 56,77.34 | 56,77.34 56,77.59 | 56,77.59 56.07,77.66 | 56.07,77.66 56.13,77.72 | 56.13,77.72 56.2,77.79 | 56.52,78.11 56.2,77.79 | 56.2,77.79 56.07,77.79 | 56.01,77.85 55.75,78.11 | 56,77.59 56,77.6 55.94,77.66 | 55.88,77.72 55.5,78.11 | 56.07,77.79 56.13,77.72 | 56.01,77.85 56.01,78.11 | 56.2,77.79 56.13,77.85 56.13,78.11 | 56.2,77.79 56.2,78.04 | 56.2,78.04 55.88,77.72 | 55.88,77.72 55.94,77.66 | 55.94,77.66 56.07,77.66 | 56.07,77.79 56.01,77.85 | 55.75,78.11 55.63,78.11 | 55.5,78.11 55.63,78.11 | 55.63,78.11 56.07,77.66 | 56.26,78.11 56.2,78.04 | 56.52,78.11 56.39,78.11 | 56.39,78.11 55.94,77.66 | 40.76,77.59 40.76,77.6 40.26,78.11 | 40.26,78.11 40.39,78.11 | 40.39,78.11 40.83,77.66 | 40.39,78.11 40.51,78.11 | 40.51,78.11 40.89,77.72 | 40.51,78.11 40.64,78.11 40.83,77.92 | 40.83,77.92 40.89,77.85 | 40.89,77.85 40.96,77.79 | 41.27,78.11 41.15,78.11 | 41.15,78.11 40.89,77.85 | 41.15,78.11 41.02,78.11 | 41.02,78.11 40.83,77.92 | 56.76,78.11 56,77.34 | 55.24,78.11 56,77.34 | 41.52,78.11 40.76,77.34 | 40,78.11 40.76,77.34
N$14
  Top 0.508: K7.A1 17.78,77.64 19.68,79.54 95.56,79.54 98.91,76.2 98.91,61.44 98.4,60.94 94.64,60.94 X10.1
N$15
  Top 0.508: K8.A1 94.61,46.35 93.98,46.99 93.98,57.78 92.08,59.69 92.08,65.41 92.71,66.04 X10.2
N$16
  Top 0.508: K9.A1 94.61,31.11 93.98,31.75 93.98,45.09 92.71,46.35 92.71,57.15 90.81,59.05 90.81,69.85 92.08,71.12 X10.3
N$17
  Top 0.305: R12.1 70.8,21.27 71.75,20.32 LED2.A
N$18
  Top 0.305: LED1.A 73.66,22.23 72.7,23.18 R13.1
N$19
  Bottom 0.305: 98.91,52.99 98.91,53.63 98.91,53.73 | 98.91,53.73 98.91,53.98 | 98.91,54.61 98.91,54.1 98.91,54 | 98.91,54 98.91,53.98 | K8.A2 98.04,53.85 98.15,53.85 98.66,53.85 98.68,53.85 98.76,53.85 | 98.76,53.85 98.79,53.85 | 98.79,53.85 98.91,53.98 | 98.79,53.85 98.91,53.73 | 98.91,54 98.76,53.85
  Bottom 0.508: K7.A2 10.28,77.59 12.23,79.54 93.81,79.54 94.61,78.74 X10.4 97,76.2 98.91,74.3 98.91,54.61 | 98.91,52.99 98.91,40.01 97.52,38.62 K9.A2 | 98.68,53.85 98.91,53.63 | 98.66,53.85 98.91,54.1 | 98.91,52.99 98.04,53.85 | 98.15,53.85 98.91,54.61 | 98.91,52.99 98.91,54.61
N$70
  Top 0.305: C5.2 58.42,25.4 57.78,24.77 57.78,23.04 57.87,22.95 IC06.3 | D3.K 46.9,20.95
  Top 0.508: 57.87,22.95 56.6,22.95 54.61,20.95 46.9,20.95
N$71
  Top 0.508: D3.A 12VIN.1 41.18,16.06 42,15.24 X4.2
PTC0
  Top 0.254: 57.42,34.27 IC1.31
  Top 0.305: 57.42,34.27 58,34.85 58,36 48.26,45.74 X5.6
PTC1
  Top 0.254: 55.71,36.65 IC1.32
  Top 0.305: 55.71,36.65 53.37,39 51.8,39 45.72,45.09 X5.7
PTD0  (via drill 0.35)
  Top 0.254: IC1.10 50.73,24.2 v52.7,22.23
  Top 0.305: R1.1 71.12,9.17 v71.12,12.7
  Bottom 0.305: v52.7,22.23 52.7,20.95 57.15,16.51 67.31,16.51 v71.12,12.7
PTD1  (via drill 0.35)
  Top 0.254: IC1.9 50.23,22.29
  Top 0.305: R2.1 78.74,9.47 v78.74,11.43 | 50.23,22.29 v50.16,22.23
  Bottom 0.305: v50.16,22.23 56.52,15.88 66.67,15.88 71.12,11.43 v78.74,11.43
PTD2  (via drill 0.35)
  Top 0.254: IC1.8 49.73,23.69 v48.9,22.86
  Top 0.305: R3.1 87,8.94 85.77,10.16 v83.19,10.16
  Bottom 0.305: v48.9,22.86 48.9,22.23 50.48,20.64 55.88,15.24 66.04,15.24 71.12,10.16 v83.19,10.16
PTD5  (via drill 0.35)
  Top 0.254: v50.16,29.21 49.61,29.21 48.23,27.82 IC1.5
  Top 0.305: K9.14 72.08,33.08 R19.2
  Bottom 0.305: K9.14 68.28,27.3 53.34,27.3 51.44,29.21 v50.16,29.21
PTD6  (via drill 0.35)
  Top 0.254: IC1.4 47.73,28.68
  Top 0.305: R18.2 72.08,44.47 K8.14 | v50.16,30.48 49.53,30.48 47.73,28.68
  Bottom 0.305: v50.16,30.48 51.44,30.48 53.88,28.04 66.77,28.04 72.08,33.35 K8.14
PTD7  (via drill 0.35)
  Top 0.254: IC1.3 47.23,26.43 v46.35,27.3
  Top 0.305: K7.14 15.13,52.4 R11.2
  Bottom 0.305: K7.14 42.88,27.3 v46.35,27.3
PTE0
  Top 0.254: IC1.2 46.73,23.73 46,23
  Top 0.305: K1.14 37.77,15.51 R4.2 38.24,22.24 39,23 46,23
PTE1
  Top 0.254: IC1.1 40.72,25.28
  Top 0.305: K2.14 37.91,29.07 R5.2 39.43,26.57 40.72,25.28
PTE2  (via drill 0.35)
  Top 0.254: 42.58,27.27 IC1.64
  Top 0.305: K3.14 28.25,46.92 R6.2 | v40.64,31.11 40.64,29.21 42.58,27.27
  Bottom 0.305: K3.14 28.25,43.51 v40.64,31.11
PTE3  (via drill 0.35)
  Top 0.254: 45.55,27.77 IC1.63
  Top 0.305: R7.2 30.55,52.4 K4.14 | v47.62,29.84 45.55,27.77
  Bottom 0.305: K4.14 33.02,41.27 44.45,29.84 v47.62,29.84
PTE4
  Top 0.254: IC1.62 42.85,28.27
  Top 0.305: R8.2 48.82,52.96 K5.14 44.15,52.4 41.91,50.16 41.91,29.21 42.85,28.27
PTE5  (via drill 0.35)
  Top 0.254: IC1.61 45.28,28.77
  Top 0.305: K6.14 62.86,53.04 R9.2 59.39,53.04 57.15,50.8 57.15,40.64 v55.88,39.37 | 45.28,28.77 v49.53,33.02
  Bottom 0.305: v49.53,33.02 v55.88,39.37
RESET  (via drill 0.35)
  Top 0.254: IC1.25 53.19,31.27
  Top 0.305: 53.19,31.27 v52.7,31.75 | C11.1 35.09,45.28 34.79,45.58 | 34.79,45.58 R17.1 | BDM.4 36.21,45.58 34.79,45.58
  Bottom 0.305: v52.7,31.75 45.72,31.75 38.81,38.66 38.81,43.74 38.35,44.2 BDM.4
SCL0/MOSI  (via drill 0.35)
  Top 0.254: IC1.28 59.44,32.77
  Top 0.305: 59.44,32.77 60.33,33.66 v60.33,38.1
  Bottom 0.305: v60.33,38.1 60.33,38.73 55.88,43.18 X5.3
SDA0/MISO  (via drill 0.35)
  Top 0.254: 54.09,32.27 IC1.27
  Top 0.305: v53.34,33.02 54.09,32.27
  Bottom 0.305: v53.34,33.02 57.15,36.83 57.15,39.37 50.8,45.72 X5.5
SPSCK0  (via drill 0.35)
  Top 0.254: IC1.29 58.03,33.27 59.05,34.29
  Top 0.305: 59.05,34.29 v59.05,38.1
  Bottom 0.305: v59.05,38.1 59.05,38.73 53.34,44.45 X5.4
SS0  (via drill 0.35)
  Top 0.254: 54.49,33.77 IC1.30
  Top 0.305: 54.49,33.77 53.34,34.92 v46.99,34.92
  Bottom 0.305: X5.8 43.18,45.72 46.99,41.91 v46.99,34.92
XTAL  (via drill 0.35)
  Top 0.254: IC1.22 58.34,29.77 v59.05,30.48
  Top 0.305: Q2.2 67.31,43.18 67.12,42.99 C3.1 R10.2 62.03,40.45 61.59,40.01 61.59,33.02 v60.96,32.38
  Bottom 0.305: v59.05,30.48 v60.96,32.38

### Text on the board
tPlace: N | N | FSS / Andreas Auer / 2021 / TFO-Meran | GND | N | GND | +5V | ANA | GND | +5V | ANA | GND | +5V | ANA
bPlace: GND | ANA | GND | GND | ANA | +5V | +5V | ANA | +5V